# EAGLE board module_alu (EAGLE 6.5.0)
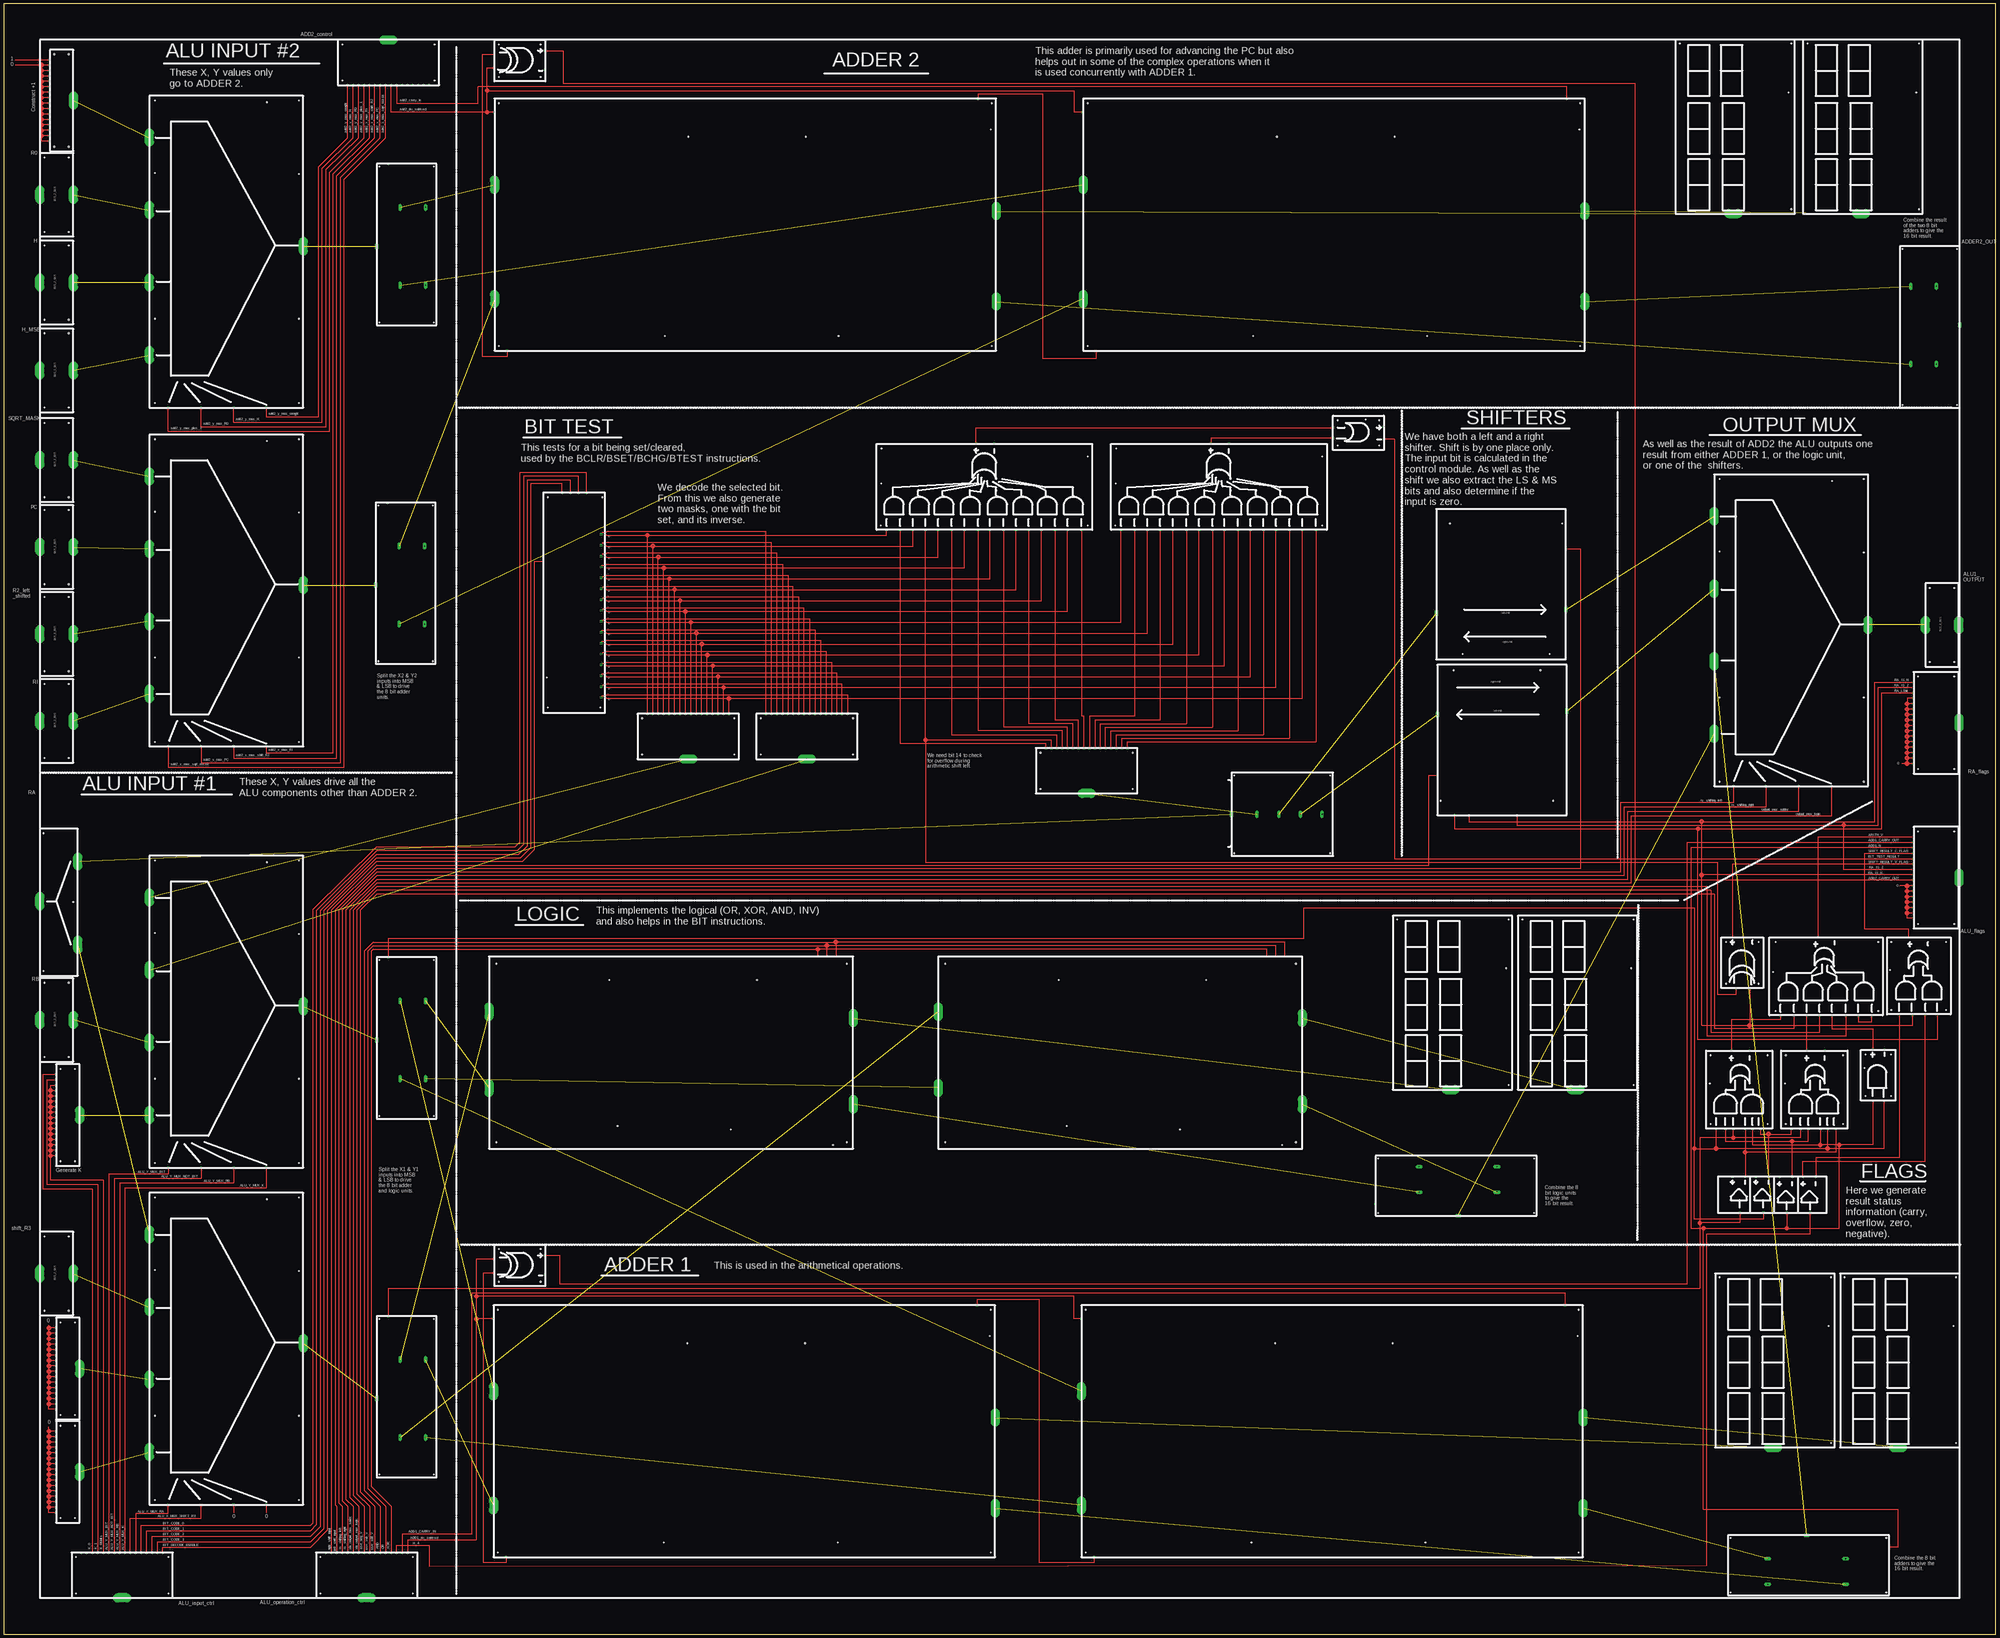
[diagram p12: board, top side]

Size 1397 x 1143 mm. Coordinates in mm from the lower left corner, seen from the top.
Outline: 0,0 1397,0 1397,1143 0,1143 0,0
Copper layers (1*16): Top 0.035mm / dielectric 1.5mm / Bottom 0.035mm
Design rules "default": minimum track width 10mil, minimum drill 24mil, track to track 8mil, track to pad 8mil, pad to pad 8mil, via to via 8mil, smd to smd 8mil, copper to edge 40mil, drill to drill 8mil, minimum pad ring 10mil, minimum via ring 8mil, stop-mask expansion 4mil, vias tented up to drill 0mil, thermal gap 10mil
tKeepout: area 16.3,16.3 to 34.5,34.5; area 689.4,16.3 to 707.6,34.5; area 1362.5,16.3 to 1380.7,34.5; area 1362.5,1108.5 to 1380.7,1126.7; area 689.4,1108.5 to 707.6,1126.7; area 16.3,1108.5 to 34.5,1126.7; area 16.3,575.1 to 34.5,593.3; area 1362.5,575.1 to 1380.7,593.3; area 689.4,575.1 to 707.6,593.3

## Footprints (pad centres in the part's own frame; a part is rotated, then mirrored left to right if it is on the bottom)
BUS_SPLIT_DISPLAY = drill 0.8 pad 6.452 long: INPUT 0,15.24 | drill 0.8 square: P$1 -28.575,-16.51; P$2 -24.765,-16.51; P$3 -20.955,-16.51; P$4 -17.145,-16.51; P$5 -13.335,-16.51; P$6 -9.525,-16.51; P$7 -5.715,-16.51; P$8 -1.905,-16.51; P$9 1.905,-16.51; P$10 5.715,-16.51; P$11 9.525,-16.51; P$12 13.335,-16.51; P$13 17.145,-16.51; P$14 20.955,-16.51; P$15 24.765,-16.51; P$16 28.575,-16.51 | hole 0.6: -32.385,-13.335; -32.385,12.065; 32.385,12.065; 32.385,-13.335
BUS_4TEE = drill 0.8 pad 2.54 long: 1 2.54,12.7; 2 2.54,-2.54; 3 2.54,-17.78; 4 2.54,-33.02; SRC 2.54,30.48 | hole 0.6: -24.765,28.575; 29.845,28.575; 29.845,-38.735; -24.765,-38.735
BUS2BUS = drill 0.8 pad 6.452 long: P$1 -1.27,12.7; P$2 -1.27,-10.795 | hole 0.6: -27.305,-7.62; -27.305,9.525; 24.765,9.525; 24.765,-7.62
SHIFT_ZERO = drill 0.8 pad 1.27: IS_ZERO 105.41,55.88; LSB 105.41,12.065; MSB 105.41,22.225; SHIFT_IN 77.47,0 | drill 0.8 pad 2.54 long: LSRC 32.385,90.805; RSRC 34.925,0 | hole 0.6: 3.81,11.43; 3.81,72.39; 95.25,2.54; 95.25,81.28
4X16MUX = drill 0.8 square: EN0 -113.03,38.735; EN1 -113.03,15.875; EN2 -113.03,-6.985; EN3 -113.03,-29.845 | drill 0.8 pad 6.452 long: PORT0 76.2,52.07; PORT1 25.4,52.07; PORT2 -25.4,52.07; PORT3 -76.2,52.07; PORTOUT 0,-55.88 | hole 0.6: -109.855,-52.705; -50.8,-52.705; 50.8,-52.705; 102.235,-52.705; 102.235,48.26; 51.435,48.26; -50.8,48.26; -109.855,48.26; 100.965,-30.48
DECODER16 = drill 0.8 square: A0 -83.82,-8.255; A1 -83.82,-2.54; A2 -83.82,3.175; A3 -83.82,8.89; E -35.56,-21.59; N0 59.69,19.05; N1 52.07,19.05; N2 44.45,19.05; N3 36.83,19.05; N4 29.21,19.05; N5 21.59,19.05; N6 13.97,19.05; N7 6.35,19.05; N8 -1.27,19.05; N9 -8.89,19.05; N10 -16.51,19.05; N11 -24.13,19.05; N12 -31.75,19.05; N13 -39.37,19.05; N14 -46.99,19.05; N15 -54.61,19.05; P0 59.69,21.59; P1 52.07,21.59; P2 44.45,21.59; P3 36.83,21.59; P4 29.21,21.59; P5 21.59,21.59; P6 13.97,21.59; P7 6.35,21.59; P8 -1.27,21.59; P9 -8.89,21.59; P10 -16.51,21.59; P11 -24.13,21.59; P12 -31.75,21.59; P13 -39.37,21.59; P14 -46.99,21.59; P15 -54.61,21.59 | hole 0.6: 66.675,18.415; -80.645,19.685; -80.645,-18.415; 66.675,-18.415; 45.72,-19.05
XOR = drill 0.8 square: OUT_N 17.78,-6.985; OUT_P 17.78,6.35; P$1 -17.78,-5.715; P$2 -17.78,3.81 | hole 0.6: -14.605,10.795; 14.605,-12.065; 14.605,10.795; -14.605,-12.065
BUS_SPLIT = drill 0.8 pad 6.452 long: INPUT -0.635,7.62 | drill 0.8 square: P$1 -29.21,-8.89; P$2 -25.4,-8.89; P$3 -21.59,-8.89; P$4 -17.78,-8.89; P$5 -13.97,-8.89; P$6 -10.16,-8.89; P$7 -6.35,-8.89; P$8 -2.54,-8.89; P$9 1.27,-8.89; P$10 5.08,-8.89; P$11 8.89,-8.89; P$12 12.7,-8.89; P$13 16.51,-8.89; P$14 20.32,-8.89; P$15 24.13,-8.89; P$16 27.94,-8.89 | hole 0.6: -33.02,-5.715; -33.02,4.445; 31.75,4.445; 31.75,-5.715
WORD_BYTE = drill 0.8 pad 2.54 long: LSB_1 -29.21,3.81; LSB_2 -29.21,-13.97; MSB_1 25.4,3.81; MSB_2 25.4,-13.97; SRC -1.905,20.32 | drill 0.8 square: MS_BIT 55.88,12.065 | hole 0.6: -55.245,-19.685; -55.245,18.415; 53.975,18.415; 53.975,-19.685
BUS_TEE = drill 0.8 pad 6.452 long: INPUT 0,15.24; OUT_A -30.48,-11.43; OUTB 27.94,-11.43 | hole 0.6: -48.895,12.7; -0.635,-8.255; 47.625,12.7
8BIT_ADD_SUB = drill 0.8 pad 6.452 long: A 48.895,-181.61; B -31.115,-181.61; DISP -12.7,170.18; R 50.8,170.18 | drill 0.8 square: C_IN -91.44,157.48; C_OUT 85.09,-172.72; INV_B -81.915,-181.61 | hole 0.6: -88.265,-178.435; 81.915,-178.435; 81.915,167.005; -88.265,167.005; 74.93,59.69; -64.77,36.83; -64.77,-45.72; 74.93,-62.23; -69.85,166.37
3X2DIGIT = drill 0.8 pad 6.452 long: P$1 -0.635,-60.96 | hole 0.6: 38.1,24.13; 40.005,-57.785; 40.005,58.42; -38.1,58.42
4BUF = drill 0.8 square: A1 -25.4,13.97; A2 -8.89,13.97; A3 7.62,13.97; A4 24.13,13.97; N1 -29.21,-11.43; N2 -12.7,-11.43; N3 3.81,-11.43; N4 20.32,-11.43; P1 -20.32,-11.43; P2 -3.81,-11.43; P3 12.7,-11.43; P4 29.21,-11.43
8BIT_LOGIC = drill 0.8 pad 6.452 long: A -29.845,-140.97; B 23.495,-140.97; DISP -25.4,114.3; R 34.925,114.3 | drill 0.8 square: AND -68.58,102.235; OR -68.58,95.885; XOR -68.58,89.535 | hole 0.6: -63.5,-135.89; -63.5,109.855; 61.595,109.855; 61.595,-135.89; 63.5,100.33; -52.07,46.99; 52.705,28.575; -52.07,-56.515; 50.165,-50.8
2X3AND_OR = drill 0.8 square: OUT_M 27.94,-6.985; OUT_P 27.94,5.715; P$1 -26.67,-14.605; P$2 -26.67,-8.89; P$3 -26.67,-3.81; P$4 -26.67,4.445; P$5 -26.67,10.16; P$6 -26.67,16.51 | hole 0.6: -23.495,-19.685; 24.765,-19.685; 24.765,20.32; -23.495,20.32; 5.08,20.955
2AND = drill 0.8 square: OUT_M 19.05,-4.445; OUT_P 19.05,3.81; P$1 -16.51,-3.81; P$2 -16.51,3.81 | hole 0.6: -13.335,8.89; 15.875,-8.89; -13.335,-8.89; 15.875,8.89; 6.35,9.525
4X2AND_OR = drill 0.8 square: OUT_M 26.67,-6.985; OUT_P 26.67,4.445; P$1 -27.94,-33.02; P$2 -27.94,-23.495; P$3 -27.94,-14.605; P$4 -27.94,-5.08; P$5 -27.94,3.81; P$6 -27.94,12.7; P$7 -27.94,21.59; P$8 -27.94,31.115 | hole 0.6: -24.765,-37.465; 23.495,-37.465; 23.495,34.608; -24.765,34.608; 2.54,36.195
8X2AND_OR = drill 0.8 square: OUT_M 29.845,-8.89; OUT_P 29.845,3.81; P$1 -30.48,-69.85; P$2 -30.48,-60.325; P$3 -30.48,-51.435; P$4 -30.48,-41.91; P$5 -30.48,-33.02; P$6 -30.48,-24.13; P$7 -30.48,-15.24; P$8 -30.48,-5.715; P$9 -30.48,2.54; P$10 -30.48,12.065; P$11 -30.48,20.955; P$12 -30.48,30.48; P$13 -30.48,39.37; P$14 -30.48,48.26; P$15 -30.48,57.15; P$16 -30.48,66.675 | hole 0.6: -27.305,-74.295; 20.955,-74.295; 26.67,70.168; -27.305,70.802; 1.905,70.485
2OR = drill 0.8 square: OUT_M 17.78,-4.445; OUT_P 17.78,4.445; P$1 -17.78,-3.81; P$2 -17.78,3.81 | hole 0.6: -14.605,8.89; 14.605,-8.89; 14.605,8.89; -14.605,-8.89; 5.08,9.525
2X2AND_OR = drill 0.8 square: OUT_M 27.94,-6.985; OUT_P 27.94,6.35; P$1 -26.035,-13.335; P$2 -26.035,-5.08; P$3 -26.035,3.81; P$4 -26.035,13.335 | hole 0.6: -22.86,18.733; 24.765,18.733; -22.86,-19.685; 24.765,-19.685; 5.08,19.685

## Placement (x,y rotation side)
CMP1  BUS_SPLIT_DISPLAY  [BUS_SPLIT_DISPLAY]  83.19,40.64 180 top
CMP2  BUS_SPLIT_DISPLAY  [BUS_SPLIT_DISPLAY]  254.63,40.64 180 top
CMP3  BUS_4TEE  [BUS_4TEE]  891.54,572.13 90 top
CMP4  BUS_2_BUS  [BUS2BUS]  38.1,254 90 top
CMP5  BUS_2_BUS  [BUS2BUS]  38.1,431.8 90 top
CMP6  BUS_2_BUS  [BUS2BUS]  38.1,641.35 90 top
CMP7  BUS_SPLIT_DISPLAY  [BUS_SPLIT_DISPLAY]  759.46,604.52 180 top
CMP8  LEFT_SHIFT_ZERO  [SHIFT_ZERO]  1095.38,683.26 90 top
CMP9  4X16MUX  [4X16MUX]  154.31,203.84 90 top
CMP10  4X16MUX  [4X16MUX]  154.31,440.06 90 top
CMP11  DECODER16  [DECODER16]  400.05,716.28 270 top
CMP12  BUS_2_BUS  [BUS2BUS]  38.1,824.23 90 top
CMP13  BUS_CONSTRUCT_DISPLAY  [BUS_SPLIT_DISPLAY]  480.06,628.65 180 top
CMP14  BUS_CONSTRUCT_DISPLAY  [BUS_SPLIT_DISPLAY]  563.25,628.65 180 top
CMP15  RIGHT_SHIFT  [SHIFT_ZERO]  1005.21,679.45 270 top
CMP16  BUS_2_BUS  [BUS2BUS]  38.1,702.31 90 top
CMP17  BUS_2_BUS  [BUS2BUS]  38.1,948.69 90 top
CMP18  XOR  [XOR]  361.95,1103.63 0 top
CMP19  BUS_CONSTRUCT_DISPLAY  [BUS_SPLIT_DISPLAY]  1355.72,638.81 270 top
CMP24  BUS_2_BUS  [BUS2BUS]  38.1,1010.28 90 top
CMP25  BUS_CONSTRUCT  [BUS_SPLIT]  45.72,113.03 270 top
CMP26  WORD_BYTE  [WORD_BYTE]  281.31,737.24 90 top
CMP27  WORD_BYTE  [WORD_BYTE]  281.94,974.73 90 top
CMP28  BUS_CONSTRUCT  [BUS_SPLIT]  45.72,185.42 270 top
CMP30  BUS_TEE  [BUS_TEE]  40.64,513.72 90 top
CMP31  8BIT_ADD_SUB  [8BIT_ADD_SUB]  937.26,139.06 270 top
CMP32  8BIT_ADD_SUB  [8BIT_ADD_SUB]  525.14,139.06 270 top
CMP33  3X2DIGIT  [3X2DIGIT]  1329.06,191.77 0 top
CMP34  3X2DIGIT  [3X2DIGIT]  1241.42,191.77 0 top
CMP35  WORD_BYTE  [WORD_BYTE]  281.94,167 90 top
CMP36  WORD_BYTE  [WORD_BYTE]  281.94,418.46 90 top
CMP38  XOR  [XOR]  1218.57,470.54 90 top
CMP39  4BUF  [4BUF]  1241.42,309.25 180 top
CMP41  3X2DIGIT  [3X2DIGIT]  1102.99,442.6 0 top
CMP42  3X2DIGIT  [3X2DIGIT]  1015.37,442.6 0 top
CMP45  XOR  [XOR]  361.95,259.08 0 top
CMP46  8BIT_LOGIC  [8BIT_LOGIC]  481.33,406.4 270 top
CMP47  8BIT_LOGIC  [8BIT_LOGIC]  796.29,406.4 270 top
CMP48  2X3AND_OR  [2X3AND_OR]  1217.3,381 90 top
CMP49  2X3AND_OR  [2X3AND_OR]  1270,381 90 top
CMP50  2AND  [2AND]  1314.45,390.52 90 top
CMP51  BUS_CONSTRUCT_DISPLAY  [BUS_SPLIT_DISPLAY]  1355.72,530.23 270 top
CMP52  4X2AND_OR  [4X2AND_OR]  1276.98,461.64 90 top
CMP53  8X2AND_OR  [8X2AND_OR]  685.8,804.54 90 top
CMP54  8X2AND_OR  [8X2AND_OR]  850.26,804.54 90 top
CMP55  2OR  [2OR]  949.96,842.01 0 top
CMP56  2X2AND_OR  [2X2AND_OR]  1342.39,460.38 90 top
CMP60  4X16MUX  [4X16MUX]  1251.59,707.39 90 top
CMP61  BUS_2_BUS  [BUS2BUS]  1360.17,708.66 90 top
CMP66  BUS_2_BUS  [BUS2BUS]  38.1,763.27 90 top
CMP68  BUS_2_BUS  [BUS2BUS]  38.1,887.1 90 top
CMP69  BUS_SPLIT_DISPLAY  [BUS_SPLIT_DISPLAY]  269.88,1102.36 0 top
CMP70  4X16MUX  [4X16MUX]  154.31,735.33 90 top
CMP71  4X16MUX  [4X16MUX]  154.31,972.82 90 top
CMP72  BUS_CONSTRUCT  [BUS_SPLIT]  41.27,1074.42 270 top
CMP82  8BIT_ADD_SUB  [8BIT_ADD_SUB]  938.53,984.88 270 top
CMP83  8BIT_ADD_SUB  [8BIT_ADD_SUB]  525.78,984.88 270 top
CMP84  3X2DIGIT  [3X2DIGIT]  1303.02,1056.64 0 top
CMP85  3X2DIGIT  [3X2DIGIT]  1213.48,1056.64 0 top
CMP93  BUS_CONSTRUCT  [BUS_SPLIT]  45.72,363.22 270 top
U$1  BYTE_WORD  [WORD_BYTE]  1017.9,313.69 180 top
U$3  BYTE_WORD  [WORD_BYTE]  1351.28,915.67 270 top
U$8  BYTE_WORD  [WORD_BYTE]  1266.19,48.9 0 top

## Tracks (layer width: path | path; a pad name or v marks a point on that pad's centre or on a via)
ADD1_CARRY_OUT
  Top 0.61: CMP45.OUT_P 389.89,265.43 389.89,245.75 1180.46,245.75 1180.46,554.99 CMP51.P$2
ADD1_LSB_CARRY_OUT
  Top 0.61: CMP31.C_OUT 764.54,50.16 726.44,50.16 726.44,234.31 682.62,234.31 CMP32.C_IN
ADD1_MSB_CARRY_OUT
  Top 0.61: CMP32.C_OUT 352.43,50.16 336.55,50.16 336.55,253.37 CMP45.P$1
ADD1_R_LSB  (1 unrouted)
ADD1_R_MSB  (1 unrouted)
ADD2_CARRY_IN
  Top 0.61: CMP82.C_IN 1096.01,1084.58 332.74,1084.58 332.74,1073.15 275.59,1073.15 CMP69.P$10
ADD2_CARRY_OUT
  Top 0.61: CMP18.OUT_P 392.43,1109.98 392.43,1087.12 1144.27,1087.12 1144.27,528.32 CMP51.P$9
ADD2_DO_SUBTRACT
  Top 0.61: CMP82.INV_B 750.57,1066.8 750.57,1082.04 339.09,1082.04 | CMP83.INV_B 339.09,1066.8 | 339.09,1066.8 339.09,1082.04 | 339.09,1066.8 271.78,1066.8 CMP69.P$9 | 339.09,1082.04 339.09,1097.91 CMP18.P$1
ADD2_LSB  (1 unrouted)
ADD2_LSB_CARRY_OUT
  Top 0.61: CMP82.C_OUT 765.81,894.08 728.98,894.08 728.98,1079.5 683.26,1079.5 CMP83.C_IN
ADD2_MSB  (1 unrouted)
ADD2_MSB_CARRY_OUT
  Top 0.61: CMP83.C_OUT 353.06,895.35 335.92,895.35 335.92,1107.44 CMP18.P$2
ADD2_X  (1 unrouted)
ADD2_X_LSB  (1 unrouted)
ADD2_X_MSB  (1 unrouted)
ADD2_X_MUX_PC
  Top 0.61: CMP70.EN1 138.43,610.87 236.22,610.87 236.22,1021.08 264.16,1049.02 CMP69.P$7
ADD2_X_MUX_RI
  Top 0.61: CMP70.EN3 184.15,617.86 231.14,617.86 231.14,1023.62 256.54,1049.02 CMP69.P$5
ADD2_X_MUX_SHIFT_R2
  Top 0.61: CMP70.EN2 161.29,614.04 233.68,614.04 233.68,1022.35 260.35,1049.02 CMP69.P$6
ADD2_X_MUX_SQRT_MASK
  Top 0.61: CMP70.EN0 115.57,607.7 238.76,607.7 238.76,1019.81 267.97,1049.02 CMP69.P$8
ADD2_Y  (1 unrouted)
ADD2_Y_LSB  (1 unrouted)
ADD2_Y_MSB  (1 unrouted)
ADD2_Y_MUX_H
  Top 0.61: CMP69.P$2 245.11,1049.02 223.52,1027.43 223.52,849.63 161.29,849.63 CMP71.EN2
ADD2_Y_MUX_P1
  Top 0.61: CMP69.P$4 252.73,1049.02 228.6,1024.89 228.6,843.28 115.57,843.28 CMP71.EN0
ADD2_Y_MUX_R0
  Top 0.61: CMP69.P$3 248.92,1049.02 226.06,1026.8 226.06,846.46 138.43,846.46 CMP71.EN1
ADD2_Y_MUX_WEIGHT
  Top 0.61: CMP71.EN3 184.15,853.44 220.98,853.44 220.98,1028.7 241.3,1049.02 CMP69.P$1
ADDER_OUT  (1 unrouted)
ALU1_X_MUX_RA
  Top 0.61: CMP1.P$6 92.71,84.45 115.57,84.45 CMP9.EN0
ALU1_X_MUX_SHIFT_R3
  Top 0.61: CMP1.P$7 88.9,81.28 138.43,81.28 CMP9.EN1
ALU1_Y_MUX_BIT
  Top 0.61: CMP1.P$11 73.66,322.58 115.57,322.58 CMP10.EN0
ALU1_Y_MUX_K
  Top 0.61: CMP1.P$8 85.09,313.06 184.15,313.06 CMP10.EN3
ALU1_Y_MUX_NOT_BIT
  Top 0.61: CMP1.P$10 77.47,319.4 138.43,319.4 CMP10.EN1
ALU1_Y_MUX_RB
  Top 0.61: CMP1.P$9 81.28,316.23 161.29,316.23 CMP10.EN2
ALU_OUTPUT_MUX_ADDER
  Top 0.61: CMP60.EN2 1258.57,576.58 1138.56,576.58 1138.56,528.96 261.62,528.96 240.03,507.37 240.03,94.61 245.11,89.53 CMP2.P$11
ALU_OUTPUT_MUX_LOGIC
  Top 0.61: CMP60.EN3 1281.43,573.4 1141.1,573.4 1141.1,526.41 261.62,526.41 242.57,507.37 242.57,95.89 248.92,89.53 CMP2.P$10
AND
  Top 0.61: CMP47.AND 898.52,485.14 583.57,485.14 | 583.57,485.14 CMP46.AND | 583.57,485.14 259.08,485.14 252.73,478.79 252.73,100.97 264.16,89.53 CMP2.P$6
ARITH_ADD_V
  Top 0.61: CMP52.P$8 1245.87,430.53 1211.58,430.53 CMP48.OUT_P
ARITH_NEG_V
  Top 0.61: CMP52.P$4 1282.07,424.18 1310.64,424.18 CMP50.OUT_P
ARITH_SUB_V
  Top 0.61: CMP49.OUT_P CMP52.P$6
ARITH_V
  Top 0.61: CMP52.OUT_P 1272.54,558.8 CMP51.P$1
BIT_CODE_0
  Top 0.61: CMP11.A0 391.8,806.45 369.57,806.45 369.57,551.18 362.58,544.2 261.62,544.2 224.79,507.37 224.79,74.3 215.26,64.77 107.95,64.77 CMP1.P$2
BIT_CODE_1
  Top 0.61: CMP11.A1 397.51,808.99 367.03,808.99 367.03,552.45 361.31,546.74 261.62,546.74 222.25,507.37 222.25,75.56 215.26,68.58 104.14,68.58 CMP1.P$3
BIT_CODE_2
  Top 0.61: CMP11.A2 403.23,811.53 364.49,811.53 364.49,553.72 360.05,549.27 261.62,549.27 219.71,507.37 219.71,76.83 215.26,72.39 100.33,72.39 CMP1.P$4
BIT_CODE_3
  Top 0.61: CMP11.A3 408.94,814.07 361.95,814.07 361.95,554.99 358.77,551.82 261.62,551.82 217.17,508 217.17,78.11 215.26,76.2 96.52,76.2 CMP1.P$5
BIT_SELECT_DECODE  (1 unrouted)
BIT_SELECT_ENABLE
  Top 0.61: CMP11.E 372.11,751.84 372.11,549.91 363.86,541.65 261.62,541.65 227.33,507.37 227.33,73.03 215.26,60.96 111.76,60.96 CMP1.P$1
BIT_TEST_RESULT
  Top 0.61: CMP51.P$5 975.36,543.56 975.36,837.57 CMP55.OUT_M
BUS_ALU1_OUTPUT  (1 unrouted)
BUS_H  (1 unrouted)
BUS_H_MSB_0XT  (1 unrouted)
BUS_K  (1 unrouted)
BUS_PC  (1 unrouted)
BUS_R0  (1 unrouted)
BUS_R2_LEFT_SHIFTED  (1 unrouted)
BUS_RA  (1 unrouted)
BUS_RA_A  (1 unrouted)
BUS_RA_B  (1 unrouted)
BUS_RA_C  (1 unrouted)
BUS_RA_D  (1 unrouted)
BUS_RB  (1 unrouted)
BUS_RI  (1 unrouted)
BUS_SHIFT_R3  (1 unrouted)
BUS_SQRT_MASK  (1 unrouted)
D_MSB
  Top 0.61: CMP35.MS_BIT 269.88,242.57 1189.36,242.57 1189.36,288.29 | CMP49.P$5 1259.84,347.98 1212.85,347.98 | 1212.85,347.98 CMP48.P$4 | 1212.85,347.98 1189.36,347.98 1189.36,288.29 | CMP39.A4 1217.3,288.29 1189.36,288.29
D_MSB_N
  Top 0.61: CMP48.P$3 1221.11,337.82 | 1221.11,337.82 CMP39.N4 | CMP49.P$1 1284.61,337.82 1221.11,337.82
DO_SUBTRACT
  Top 0.61: CMP32.INV_B 331.47,220.98 | 331.47,220.98 331.47,66.04 283.21,66.04 CMP2.P$1 | CMP45.P$2 331.47,262.89 331.47,236.85 | 331.47,236.85 331.47,220.98 | CMP31.INV_B 750.57,220.98 750.57,236.85 331.47,236.85
H_4
  Top 0.61: CMP2.P$3 275.59,62.23 298.45,62.23 298.45,47.62 1194.43,48.26 1194.43,280.67 1266.83,280.67 CMP39.A1
INPUT_CARRY_BIT
  Top 0.61: CMP31.C_IN 1094.74,239.4 328.3,239.4 328.3,69.85 279.4,69.85 CMP2.P$2
INVER_BIT  (1 unrouted)
IS_SHIFTING_LEFT
  Top 0.61: CMP60.EN0 1212.85,582.93 1133.47,582.93 1133.47,534.03 261.62,534.03 234.95,507.37 234.95,92.08 237.49,89.53 CMP2.P$13
IS_SHIFTING_RIGHT
  Top 0.61: CMP60.EN1 1235.71,579.75 1136.02,579.75 1136.02,531.5 261.62,531.5 237.49,507.37 237.49,93.34 241.3,89.53 CMP2.P$12
K_0
  Top 0.61: CMP93.P$1 27.94,392.43 27.94,311.79 62.23,311.79 CMP1.P$14
K_1
  Top 0.61: CMP93.P$2 30.48,388.62 30.48,314.96 66.04,314.96 CMP1.P$13
K_N
  Top 0.61: 33.02,335.28 33.02,318.13 69.85,318.13 CMP1.P$12 | 33.02,335.28 33.02,339.09 | 33.02,339.09 33.02,342.9 | 33.02,342.9 33.02,346.71 | 33.02,346.71 33.02,350.52 | 33.02,350.52 33.02,354.33 | 33.02,354.33 33.02,358.14 | 33.02,358.14 33.02,361.95 | 33.02,361.95 33.02,365.76 | 33.02,365.76 33.02,369.57 | 33.02,369.57 33.02,373.38 | 33.02,373.38 33.02,377.19 | 33.02,377.19 33.02,381 | 33.02,381 33.02,384.81 CMP93.P$3 | CMP93.P$4 33.02,381 | CMP93.P$5 33.02,377.19 | CMP93.P$16 33.02,335.28 | CMP93.P$14 33.02,342.9 | CMP93.P$15 33.02,339.09 | CMP93.P$13 33.02,346.71 | CMP93.P$12 33.02,350.52 | CMP93.P$11 33.02,354.33 | CMP93.P$10 33.02,358.14 | CMP93.P$9 33.02,361.95 | CMP93.P$8 33.02,365.76 | CMP93.P$7 33.02,369.57 | CMP93.P$6 33.02,373.38
LEFT_SHIFT_INPUT
  Top 0.61: CMP8.SHIFT_IN 1105.54,760.73 1105.54,536.58 261.62,536.58 232.41,507.37 232.41,90.81 233.68,89.53 CMP2.P$14
LEFT_SHIFTER  (1 unrouted)
LOGIC_OUT  (1 unrouted)
LOGIC_R_LSB  (1 unrouted)
LOGIC_R_MSB  (1 unrouted)
MASK_0
  Top 0.61: CMP11.P0 422.27,656.59 422.91,655.96 508.63,655.96 | CMP13.P$1 508.63,655.96 | 508.63,655.96 910.59,655.96 CMP54.P$2
MASK_1
  Top 0.61: CMP11.P1 422.27,664.21 422.91,663.58 504.82,663.58 | CMP13.P$2 504.82,663.58 | 504.82,663.58 892.17,663.58 CMP54.P$4
MASK_2
  Top 0.61: CMP11.P2 422.27,671.83 422.91,671.2 501.01,671.2 | CMP13.P$3 501.01,671.2 | 501.01,671.2 874.39,671.2 CMP54.P$6
MASK_3
  Top 0.61: CMP11.P3 422.27,679.45 422.91,678.82 497.2,678.82 | CMP13.P$4 497.2,678.82 | 497.2,678.82 855.98,678.82 CMP54.P$8
MASK_4
  Top 0.61: CMP11.P4 422.27,687.07 422.91,686.43 493.39,686.43 | CMP13.P$5 493.39,686.43 | 493.39,686.43 838.2,686.43 CMP54.P$10
MASK_5
  Top 0.61: CMP11.P5 422.27,694.69 422.91,694.05 489.58,694.05 | CMP13.P$6 489.58,694.05 | 489.58,694.05 819.78,694.05 CMP54.P$12
MASK_6
  Top 0.61: CMP11.P6 422.27,702.31 422.91,701.67 485.77,701.67 | CMP13.P$7 485.77,701.67 | 485.77,701.67 802,701.67 CMP54.P$14
MASK_7
  Top 0.61: CMP11.P7 422.27,709.93 422.91,709.29 481.96,709.29 | CMP13.P$8 481.96,709.29 | 481.96,709.29 783.59,709.29 CMP54.P$16
MASK_8
  Top 0.61: CMP11.P8 422.27,717.55 422.91,716.91 478.15,716.91 | CMP13.P$9 478.15,716.91 | 478.15,716.91 746.12,716.91 CMP53.P$2
MASK_9
  Top 0.61: CMP11.P9 422.27,725.17 422.91,724.53 474.35,724.53 | CMP13.P$10 474.35,724.53 | 474.35,724.53 727.71,724.53 CMP53.P$4
MASK_10
  Top 0.61: CMP11.P10 422.27,732.79 422.91,732.15 470.54,732.15 | CMP13.P$11 470.54,732.15 | 470.54,732.15 709.93,732.15 CMP53.P$6
MASK_11
  Top 0.61: CMP11.P11 422.27,740.41 422.91,739.77 466.73,739.77 | CMP13.P$12 466.73,739.77 | 466.73,739.77 691.51,739.77 CMP53.P$8
MASK_12
  Top 0.61: CMP11.P12 422.27,748.03 422.91,747.39 462.92,747.39 | CMP13.P$13 462.92,747.39 | 462.92,747.39 673.74,747.39 CMP53.P$10
MASK_13
  Top 0.61: CMP11.P13 422.27,755.65 422.91,755.01 459.11,755.01 | CMP13.P$14 459.11,755.01 | 459.11,755.01 655.32,755.01 CMP53.P$12
MASK_14
  Top 0.61: CMP11.P14 422.27,763.27 422.91,762.63 455.3,762.63 | CMP13.P$15 455.3,762.63 | 455.3,762.63 637.54,762.63 CMP53.P$14
MASK_15
  Top 0.61: CMP11.P15 422.27,770.89 422.91,770.25 451.49,770.25 | CMP13.P$16 451.49,770.25 | 451.49,770.25 619.12,770.25 CMP53.P$16
N$1  (1 unrouted)
  Top 0.61: CMP9.EN2 161.29,85.09 | CMP9.EN3 184.15,85.09
N$2
  Top 0.61: 8.26,1103.63 CMP72.P$1
N$3
  Top 0.61: CMP72.P$16 26.67,1046.48 26.67,1050.29 | 26.67,1050.29 26.67,1054.1 | 26.67,1054.1 26.67,1057.91 | 26.67,1057.91 26.67,1061.72 | 26.67,1061.72 26.67,1065.53 | 26.67,1065.53 26.67,1069.34 | 26.67,1069.34 26.67,1073.15 | 26.67,1073.15 26.67,1076.96 | 26.67,1076.96 26.67,1080.77 | 26.67,1080.77 26.67,1084.58 | 26.67,1084.58 26.67,1088.39 | 26.67,1088.39 26.67,1092.2 | 26.67,1092.2 26.67,1096.01 | 26.67,1096.01 26.67,1099.82 | 26.67,1099.82 8.26,1099.82 | CMP72.P$2 26.67,1099.82 | CMP72.P$3 26.67,1096.01 | CMP72.P$4 26.67,1092.2 | CMP72.P$5 26.67,1088.39 | CMP72.P$6 26.67,1084.58 | CMP72.P$7 26.67,1080.77 | CMP72.P$8 26.67,1076.96 | CMP72.P$9 26.67,1073.15 | CMP72.P$10 26.67,1069.34 | CMP72.P$11 26.67,1065.53 | CMP72.P$12 26.67,1061.72 | CMP72.P$13 26.67,1057.91 | CMP72.P$14 26.67,1054.1 | CMP72.P$15 26.67,1050.29
N$4
  Top 0.61: CMP25.P$1 31.75,142.24 | 31.75,142.24 31.75,145.41 | CMP25.P$2 31.75,138.43 | 31.75,138.43 31.75,142.24 | CMP25.P$15 31.75,88.9 | 31.75,88.9 31.75,92.71 | 31.75,92.71 31.75,96.52 | 31.75,96.52 31.75,100.33 | 31.75,100.33 31.75,104.14 | 31.75,104.14 31.75,107.95 | 31.75,107.95 31.75,111.76 | 31.75,111.76 31.75,115.57 | 31.75,115.57 31.75,119.38 | 31.75,119.38 31.75,123.19 | 31.75,123.19 31.75,127 | 31.75,127 31.75,130.81 | 31.75,130.81 31.75,134.62 | 31.75,134.62 31.75,138.43 | CMP25.P$16 31.75,85.09 31.75,88.9 | CMP25.P$14 31.75,92.71 | CMP25.P$13 31.75,96.52 | CMP25.P$12 31.75,100.33 | CMP25.P$11 31.75,104.14 | CMP25.P$10 31.75,107.95 | CMP25.P$9 31.75,111.76 | CMP25.P$8 31.75,115.57 | CMP25.P$7 31.75,119.38 | CMP25.P$6 31.75,123.19 | CMP25.P$5 31.75,127 | CMP25.P$4 31.75,130.81 | CMP25.P$3 31.75,134.62
N$5
  Top 0.61: CMP19.P$16 1334.77,610.24 | 1334.77,610.24 1330.96,610.24 | CMP19.P$4 1334.77,655.96 1334.77,652.14 | 1334.77,652.14 1334.77,648.34 | 1334.77,648.34 1334.77,644.52 | 1334.77,644.52 1334.77,640.72 | 1334.77,640.72 1334.77,636.9 | 1334.77,636.9 1334.77,633.1 | 1334.77,633.1 1334.77,629.28 | 1334.77,629.28 1334.77,625.48 | 1334.77,625.48 1334.77,621.66 | 1334.77,621.66 1334.77,617.86 | 1334.77,617.86 1334.77,614.04 | 1334.77,614.04 1334.77,610.24 | CMP19.P$15 1334.77,614.04 | CMP19.P$14 1334.77,617.86 | CMP19.P$13 1334.77,621.66 | CMP19.P$12 1334.77,625.48 | CMP19.P$11 1334.77,629.28 | CMP19.P$10 1334.77,633.1 | CMP19.P$9 1334.77,636.9 | CMP19.P$7 1334.77,644.52 | CMP19.P$8 1334.77,640.72 | CMP19.P$6 1334.77,648.34 | CMP19.P$5 1334.77,652.14
N$6
  Top 0.61: CMP51.P$10 1334.77,524.51 | 1334.77,524.51 1329.69,524.51 | CMP51.P$16 1334.77,501.65 1334.77,505.46 | 1334.77,505.46 1334.77,509.27 | 1334.77,509.27 1334.77,513.08 | 1334.77,513.08 1334.77,516.89 | 1334.77,516.89 1334.77,520.7 | 1334.77,520.7 1334.77,524.51 | CMP51.P$11 1334.77,520.7 | CMP51.P$12 1334.77,516.89 | CMP51.P$13 1334.77,513.08 | CMP51.P$14 1334.77,509.27 | CMP51.P$15 1334.77,505.46
N$7
  Top 0.61: CMP28.P$1 31.75,214.63 | 31.75,214.63 31.75,216.53 | CMP28.P$2 31.75,210.82 | 31.75,210.82 31.75,214.63 | CMP28.P$16 31.75,157.48 31.75,161.29 | 31.75,161.29 31.75,165.1 | 31.75,165.1 31.75,168.91 | 31.75,168.91 31.75,172.72 | 31.75,172.72 31.75,176.53 | 31.75,176.53 31.75,180.34 | 31.75,180.34 31.75,184.15 | 31.75,184.15 31.75,187.96 | 31.75,187.96 31.75,191.77 | 31.75,191.77 31.75,195.58 | 31.75,195.58 31.75,199.39 | 31.75,199.39 31.75,203.2 | 31.75,203.2 31.75,207.01 | 31.75,207.01 31.75,210.82 | CMP28.P$3 31.75,207.01 | CMP28.P$5 31.75,199.39 | CMP28.P$4 31.75,203.2 | CMP28.P$6 31.75,195.58 | CMP28.P$7 31.75,191.77 | CMP28.P$8 31.75,187.96 | CMP28.P$9 31.75,184.15 | CMP28.P$10 31.75,180.34 | CMP28.P$12 31.75,172.72 | CMP28.P$11 31.75,176.53 | CMP28.P$13 31.75,168.91 | CMP28.P$14 31.75,165.1 | CMP28.P$15 31.75,161.29
N$20
  Top 0.61: CMP11.N0 419.1,657.23 419.74,657.86 422.27,657.86 422.91,658.5 591.82,658.5 CMP14.P$1
N$21
  Top 0.61: CMP11.N1 420.37,665.48 422.27,665.48 422.91,666.12 588.01,666.12 CMP14.P$2
N$22
  Top 0.61: CMP11.N2 419.1,672.47 419.74,673.1 422.27,673.1 422.91,673.74 584.2,673.74 CMP14.P$3
N$23
  Top 0.61: CMP11.N3 419.1,680.09 419.74,680.72 422.27,680.72 422.91,681.36 580.39,681.36 CMP14.P$4
N$24
  Top 0.61: CMP11.N4 420.37,688.34 422.27,688.34 422.91,688.98 576.58,688.98 CMP14.P$5
N$25
  Top 0.61: CMP11.N5 419.1,695.33 419.74,695.96 422.27,695.96 422.91,696.6 572.77,696.6 CMP14.P$6
N$26
  Top 0.61: CMP11.N6 419.1,702.95 419.74,703.58 422.27,703.58 422.91,704.22 568.96,704.22 CMP14.P$7
N$27
  Top 0.61: CMP11.N7 420.37,711.2 422.27,711.2 422.91,711.84 565.15,711.84 CMP14.P$8
N$28
  Top 0.61: CMP11.N8 420.37,718.82 422.27,718.82 422.91,719.46 561.34,719.46 CMP14.P$9
N$29
  Top 0.61: CMP11.N9 420.37,726.44 422.27,726.44 422.91,727.08 557.53,727.08 CMP14.P$10
N$30
  Top 0.61: CMP11.N10 420.37,734.06 422.27,734.06 422.91,734.7 553.72,734.7 CMP14.P$11
N$31
  Top 0.61: CMP11.N11 420.37,741.68 422.27,741.68 422.91,742.32 549.91,742.32 CMP14.P$12
N$32
  Top 0.61: CMP11.N12 419.1,748.66 419.74,749.3 422.27,749.3 422.91,749.93 546.1,749.93 CMP14.P$13
N$33
  Top 0.61: CMP14.P$14 542.29,757.55 422.91,757.55 422.27,756.92 419.74,756.92 CMP11.N13
N$34
  Top 0.61: CMP14.P$15 538.48,765.17 422.91,765.17 422.27,764.54 419.74,764.54 CMP11.N14
N$35
  Top 0.61: CMP14.P$16 534.67,772.79 422.91,772.79 422.27,772.16 419.74,772.16 CMP11.N15
N$67  (1 unrouted)
N$68  (1 unrouted)
N$89  (1 unrouted)
N$90  (1 unrouted)
N$108
  Top 0.61: CMP53.OUT_P 681.99,845.82 CMP55.P$2
N$109
  Top 0.61: CMP55.P$1 846.46,838.2 CMP54.OUT_P
N$115
  Top 0.61: CMP52.P$2 1300.48,429.26 1310.01,429.26 CMP52.P$1
N$143  (1 unrouted)
N$144  (1 unrouted)
OR
  Top 0.61: CMP47.OR 892.17,482.6 577.22,482.6 | 577.22,482.6 CMP46.OR | 577.22,482.6 259.08,482.6 255.27,478.79 255.27,102.23 267.97,89.53 CMP2.P$5
PLUS_1  (1 unrouted)
R_MSB
  Top 0.61: U$8.MS_BIT 1328.42,60.96 1328.42,87.63 1191.89,87.63 1191.89,284.48 | CMP48.P$2 1226.18,342.9 1273.81,342.9 | CMP49.P$3 1273.81,342.9 | CMP50.P$2 1310.64,342.9 1287.14,342.9 | 1287.14,342.9 1273.81,342.9 | CMP39.A2 1250.32,284.48 | 1250.32,284.48 1287.14,284.48 1287.14,342.9 | 1191.89,284.48 1250.32,284.48 | CMP51.P$3 1183.01,551.18 1183.01,284.48 1191.89,284.48
R_MSB_N
  Top 0.61: CMP48.P$5 1207.13,345.44 1254.12,345.44 | 1254.12,345.44 1265.56,345.44 CMP49.P$4 | CMP39.N2 1254.12,345.44
RA_0
  Top 0.61: CMP7.P$1 788.03,625.48 920.12,625.48 CMP54.P$1
RA_1
  Top 0.61: CMP7.P$2 784.23,628.01 901.7,628.01 CMP54.P$3
RA_2
  Top 0.61: CMP7.P$3 780.41,630.55 883.28,630.55 CMP54.P$5
RA_3
  Top 0.61: CMP7.P$4 776.61,633.1 865.5,633.1 CMP54.P$7
RA_4
  Top 0.61: CMP7.P$5 772.79,635.63 847.73,635.63 CMP54.P$9
RA_5
  Top 0.61: CMP7.P$6 768.99,638.17 829.31,638.17 CMP54.P$11
RA_6
  Top 0.61: CMP7.P$7 765.17,640.72 810.89,640.72 CMP54.P$13
RA_7
  Top 0.61: CMP7.P$8 761.37,643.25 793.12,643.25 CMP54.P$15
RA_8
  Top 0.61: CMP7.P$9 757.55,643.25 755.65,643.25 CMP53.P$1
RA_9
  Top 0.61: CMP7.P$10 753.75,640.72 737.24,640.72 CMP53.P$3
RA_10
  Top 0.61: CMP7.P$11 749.93,638.17 718.82,638.17 CMP53.P$5
RA_11
  Top 0.61: CMP7.P$12 746.12,635.63 701.04,635.63 CMP53.P$7
RA_12
  Top 0.61: CMP7.P$13 742.32,633.1 683.26,633.1 CMP53.P$9
RA_13
  Top 0.61: CMP7.P$14 738.5,629.92 664.85,629.92 CMP53.P$11
RA_14
  Top 0.61: CMP7.P$15 734.7,626.75 646.43,626.75 | 646.43,626.75 CMP53.P$13 | 646.43,626.75 646.43,541.02 1202.06,541.02 1202.06,448.31 1214.76,448.31 CMP38.P$2
RA_15
  Top 0.61: CMP7.P$16 730.88,624.21 628.65,624.21 CMP53.P$15
RA_IS_Z
  Top 0.61: CMP15.IS_ZERO 1061.09,567.05 1290.32,567.05 | 1290.32,567.05 1314.45,567.05 1314.45,663.58 CMP19.P$2 | CMP51.P$7 1290.32,535.94 1290.32,567.05
RA_LSB
  Top 0.61: CMP15.LSB 1017.27,564.51 1188.09,564.51 | 1188.09,564.51 1316.99,564.51 1316.99,659.76 CMP19.P$3 | CMP56.P$1 1355.72,416.56 1188.09,416.56 1188.09,564.51
RA_MSB
  Top 0.61: CMP15.MSB 1027.43,569.6 1190.62,569.6 | 1190.62,569.6 1311.91,569.6 1311.91,667.38 CMP19.P$1 | 1224.28,426.72 1190.62,426.72 1190.62,532.13 | 1224.28,426.72 1338.58,426.72 CMP56.P$3 | 1190.62,532.13 1190.62,569.6 | CMP51.P$8 1190.62,532.13 | CMP38.P$1 1224.28,426.72
RIGHT_SHIFT_INPUT
  Top 0.61: CMP15.SHIFT_IN 999.49,601.98 999.49,539.12 261.62,539.12 229.87,507.37 CMP2.P$15
RIGHT_SHIFTER  (1 unrouted)
S_MSB
  Top 0.61: CMP36.MS_BIT 269.88,487.68 911.86,487.68 911.86,509.27 1185.55,509.27 1185.55,340.36 | 1185.55,340.36 1200.79,340.36 | 1200.79,340.36 CMP48.P$6 | CMP49.P$2 1278.89,340.36 | 1278.89,340.36 1200.79,340.36 | CMP39.A3 1233.81,290.83 1185.55,290.83 1185.55,340.36 | CMP50.P$1 1318.26,340.36 1278.89,340.36
S_MSB_N
  Top 0.61: CMP48.P$1 1231.9,350.52 1237.62,350.52 | 1237.62,350.52 1253.49,350.52 CMP49.P$6 | CMP39.N3 1237.62,350.52
SHIFT_LEFT
  Top 0.61: CMP56.P$4 1329.06,334.01 1270.63,334.01 CMP39.N1
SHIFT_RESULT_C_FLAG
  Top 0.61: CMP56.OUT_P 1336.04,494.03 1304.92,494.03 1304.92,547.37 CMP51.P$4
SHIFT_RESULT_V_FLAG
  Top 0.61: CMP51.P$6 1212.21,539.75 CMP38.OUT_P
SHIFT_RIGHT
  Top 0.61: CMP39.P1 1261.74,331.47 1347.47,331.47 CMP56.P$2
USE_ADD_V
  Top 0.61: CMP2.P$7 260.35,89.53 250.19,99.69 250.19,507.37 261.62,518.79 1199.52,518.79 1199.52,424.18 1255.39,424.18 CMP52.P$7
USE_NEG_V
  Top 0.61: CMP2.P$9 252.73,89.53 245.11,97.16 245.11,507.37 261.62,523.88 1194.43,523.88 1194.43,419.1 1291.59,419.1 CMP52.P$3
USE_SUB_V
  Top 0.61: CMP2.P$8 256.54,89.53 247.65,98.42 247.65,507.37 261.62,521.34 1196.97,521.34 1196.97,421.64 1273.17,421.64 CMP52.P$5
X  (1 unrouted)
X_LSB_A  (1 unrouted)
X_LSB_B  (1 unrouted)
X_MSB_A  (1 unrouted)
X_MSB_B  (1 unrouted)
XOR
  Top 0.61: CMP47.XOR 885.83,480.06 570.87,480.06 | 570.87,480.06 CMP46.XOR | 570.87,480.06 259.08,480.06 257.81,478.79 257.81,103.5 271.78,89.53 CMP2.P$4
Y  (1 unrouted)
Y_LSB_A  (1 unrouted)
Y_LSB_B  (1 unrouted)
Y_MSB_A  (1 unrouted)
Y_MSB_B  (1 unrouted)
ZERO_A  (1 unrouted)
ZERO_B  (1 unrouted)
(copper drawn outside any net)
  shapes: Top circle x116

## Text on the board
tPlace: ADD2_control | ALU INPUT #2 | 1 | 0 | ADDER 2 | This adder is primarily used for advancing the PC but also / helps out in some of the complex operations when it / is used concurrently with ADDER 1. | These X, Y values only / go to ADDER 2. | add2_carry_in | add2_do_subtract | Construct +1 | add2_y_mux_weight | add2_y_mux_H | add2_y_mux_R0 | add2_y_mux_plus_1 | add2_x_mux_RI | add2_x_mux_shift_R2 | add2_x_mux_PC | add2_x_mux_sqrt_mask | R0 | Combine the result / of the two 8 bit / adders to give the / 16 bit result. | H | ADDER2_OUT | H_MSB | add2_y_mux_weight | SQRT_MASK | add2_y_mux_H | add2_y_mux_R0 | SHIFTERS | add2_y_mux_plus_1 | OUTPUT MUX | BIT TEST | This tests for a bit being set/cleared, / used by the BCLR/BSET/BCHG/BTEST instructions. | As well as the result of ADD2 the ALU outputs one / result from either ADDER 1, or the logic unit, / or one of the shifters. | We have both a left and a right / shifter. Shift is by one place only. / The input bit is calculated in the / control module. As well as the / shift we also extract the LS & MS / bits and also determine if the / input is zero. | PC | We decode the selected bit. / From this we also generate / two masks, one with the bit / set, and its inverse. | - | + | - | + | - | + | - | + | - | + | ALU1_ / OUTPUT | - | + | - | R2_left / _shifted | + | - | + | - | + | - | + | - | + | - | + | - | + | - | + | RA_IS_N | RI | - | RA_IS_Z | + | RA_LSbit | - | Split the X2 & Y2 / inputs into MSB / & LSB to drive / the 8 bit adder / units. | + | add2_x_mux_RI | add2_x_mux_shift_R2 | add2_x_mux_PC | 0 | add2_x_mux_sqrt_mask | We need bit 14 to check / for overflow during / arithmetic shift left. | RA_flags | ALU INPUT #1 | RA | These X, Y values drive all the / ALU components other than ADDER 2. | is_shifting_left | is_shifting_right | output_mux_adder | output_mux_logic | ARITH_V | ADD1_CARRY_OUT | ADD1_N | SHIFT_RESULT_C_FLAG | BIT_TEST_RESULT | SHIFT_RESULT_V_FLAG | RA_IS_Z | RA_IS_N | ADD2_CARRY_OUT | 0 | LOGIC | This implements the logical (OR, XOR, AND, INV) / and also helps in the BIT instructions. | ALU_flags | RB | Generate K | ALU_Y_MUX_BIT | ALU_Y_MUX_NOT_BIT | FLAGS | ALU_Y_MUX_RB | ALU_Y_MUX_K | Split the X1 & Y1 / inputs into MSB / & LSB to drive / the 8 bit adder / and logic units. | Combine the 8 / bit logic units / to give the / 16 bit result. | shift_R3 | Here we generate / result status / information (carry, / overflow, zero, / negative). | This is used in the arithmetical operations. | ADDER 1 | 0 | 0 | ALU_X_MUX_RA | ALU_X_MUX_SHIFT_R3 | 0 | 0 | BIT_CODE_0 | BIT_CODE_1 | ADD1_CARRY_IN | BIT_CODE_2 | ADD1_do_subtract | BIT_CODE_3 | H_4 | BIT_DECODE_ENABLE | K_0 | K_1 | K_MSbits | is_shifting_left | is_shifting_right | use_neg_V | AND | OR | XOR | ALU_Y_MUX_BIT | ALU_Y_MUX_NOT_BIT | ALU_Y_MUX_RB | ALU_Y_MUX_K | right_shift_input | alu_output_mux_adder | alu_output_mux_logic | use_sub_V | use_add_V | left_shift_input | Combine the 8 bit / adders to give the / 16 bit result. | ALU_operation_ctrl | ALU_input_ctrl